# Altium schematic sheet Title Page.SchDoc
size A4; SheetNumber: 1; SheetTotal: 1
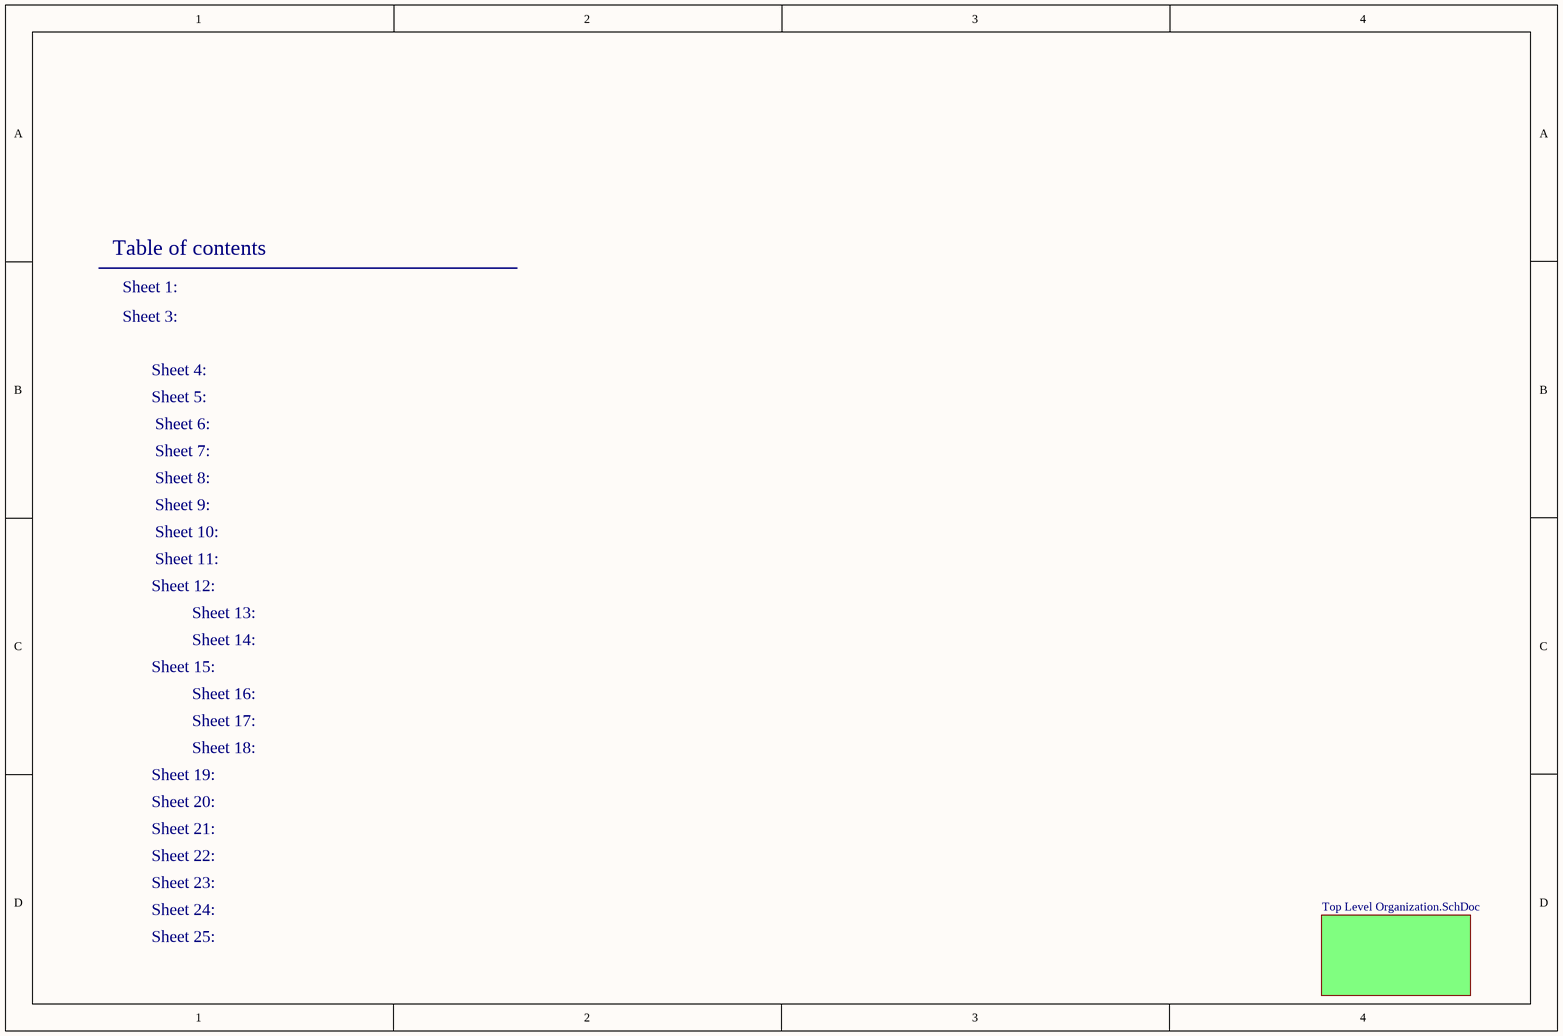
[diagram p0: Title Page.SchDoc]

## Sub-sheets
Designator = Top Level Organization.SchDoc: no entries

## Notes on the sheet
- Table of contents
- Sheet 1:
- Sheet 3:
- Sheet 4:
- Sheet 5:
- Sheet 6:
- Sheet 7:
- Sheet 8:
- Sheet 9:
- Sheet 10:
- Sheet 11:
- Sheet 12:
- Sheet 13:
- Sheet 14:
- Sheet 15:
- Sheet 16:
- Sheet 19:
- Sheet 17:
- Sheet 18:
- Sheet 20:
- Sheet 21:
- Sheet 22:
- Sheet 23:
- Sheet 24:
- Sheet 25: